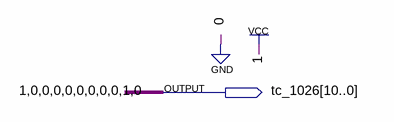
[diagram p0: schematic sheet]
// Quartus schematic tc_1026.bdf as structural Verilog: 0 symbols, 1 pins
module tc_1026 (
  output [10:0] tc_1026
);


  assign tc_1026 = 11'b10000000010;
endmodule
